# EAGLE design attiny85 (EAGLE 9.6.2)
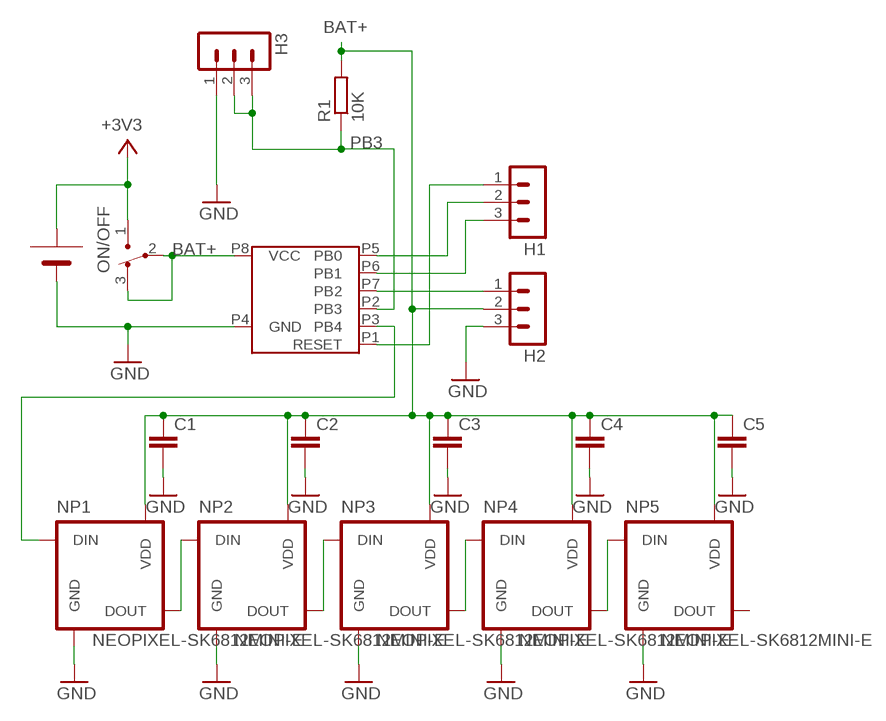
[diagram p0: schematic, sheet 1]

## Parts
ATTINY85-1  ATTINY85  ATTINY85SOP8  [ATTINY85-20SUR]
BAT1  BAT-CR2032C  [BAT-CR2032-3]
C1  C-EUC2012  [C2012]
C2  C-EUC2012  [C2012]
C3  C-EUC2012  [C2012]
C4  C-EUC2012  [C2012]
C5  C-EUC2012  [C2012]
H1  PINHEAD-MA03-1SMD  [PINHEAD-MA03-2]
H2  PINHEAD-MA03-1SMD  [PINHEAD-MA03-2]
H3  PINHEAD-MA03-1  [PINHEAD-MA03-1]
NP1  NEOPIXEL-SK6812MINI-E  [SK6812MINI-E]
NP2  NEOPIXEL-SK6812MINI-E  [SK6812MINI-E]
NP3  NEOPIXEL-SK6812MINI-E  [SK6812MINI-E]
NP4  NEOPIXEL-SK6812MINI-E  [SK6812MINI-E]
NP5  NEOPIXEL-SK6812MINI-E  [SK6812MINI-E]
ON/OFF  POWER  SW3-1  [SW3-1]
R1  10K  R-EU_M3216  [M3216]

## Nets
+3V3: BAT1.V+(BAT+) ON/OFF.1
BAT+: ATTINY85-1.P8(VCC) C1.1 C2.1 C3.1 C4.1 C5.1 H2.2 NP1.VDD NP2.VDD NP3.VDD NP4.VDD NP5.VDD ON/OFF.2 ON/OFF.3 R1.2
GND: ATTINY85-1.P4(GND) BAT1.V- C1.2 C2.2 C3.2 C4.2 C5.2 H2.3 H3.1 NP1.GND NP2.GND NP3.GND NP4.GND NP5.GND
N$1: ATTINY85-1.P3(PB4) NP1.DIN
N$2: ATTINY85-1.P7(PB2) H2.1
N$3: ATTINY85-1.P6(PB1) H1.3
N$4: ATTINY85-1.P1(RESET) H1.1
N$5: ATTINY85-1.P5(PB0) H1.2
N$6: NP1.DOUT NP2.DIN
N$7: NP2.DOUT NP3.DIN
N$8: NP3.DOUT NP4.DIN
N$9: NP4.DOUT NP5.DIN
PB3: ATTINY85-1.P2(PB3) H3.2 H3.3 R1.1
Unconnected: NP5.DOUT

## Library data of the parts
ATTINY85-1 = ytani1:ATTINY85
BAT1 = ytani1:BAT-CR2032
C1-C5 = rcl:C-EU: CAPACITOR, European symbol; SPICEPREFIX: C
H1 H2 = ytani1:PINHEAD-MA03-1: PIN HEADER
H3 = ytani1:PINHEAD-MA03-1: PIN HEADER; OC_FARNELL: unknown; OC_NEWARK: unknown
NP1-NP5 = ytani1:NEOPIXEL
ON/OFF = ytani1:SW3-1: Slide Switch 3x1 pin https://www.amazon.co.jp/gp/product/B01LYVYQNO/ SS12D00G3 2ポジションSPDT 1P2T 3ピン; MF: HiLetgo; URL_AMAZON: https://www.amazon.co.jp/gp/product/B01LYVYQNO/
R1 = rcl:R-EU_: RESISTOR, European symbol; SPICEPREFIX: R

## Board
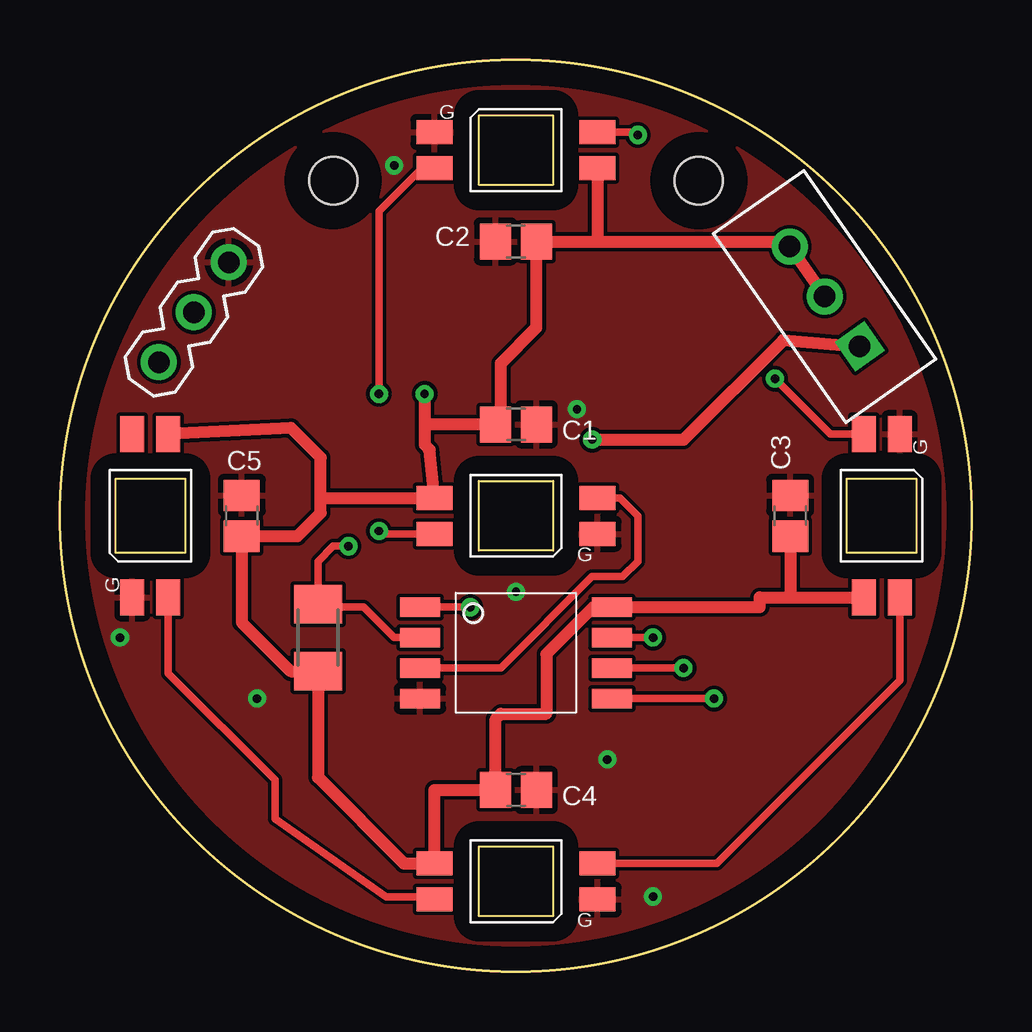
[diagram p1: board, top side]
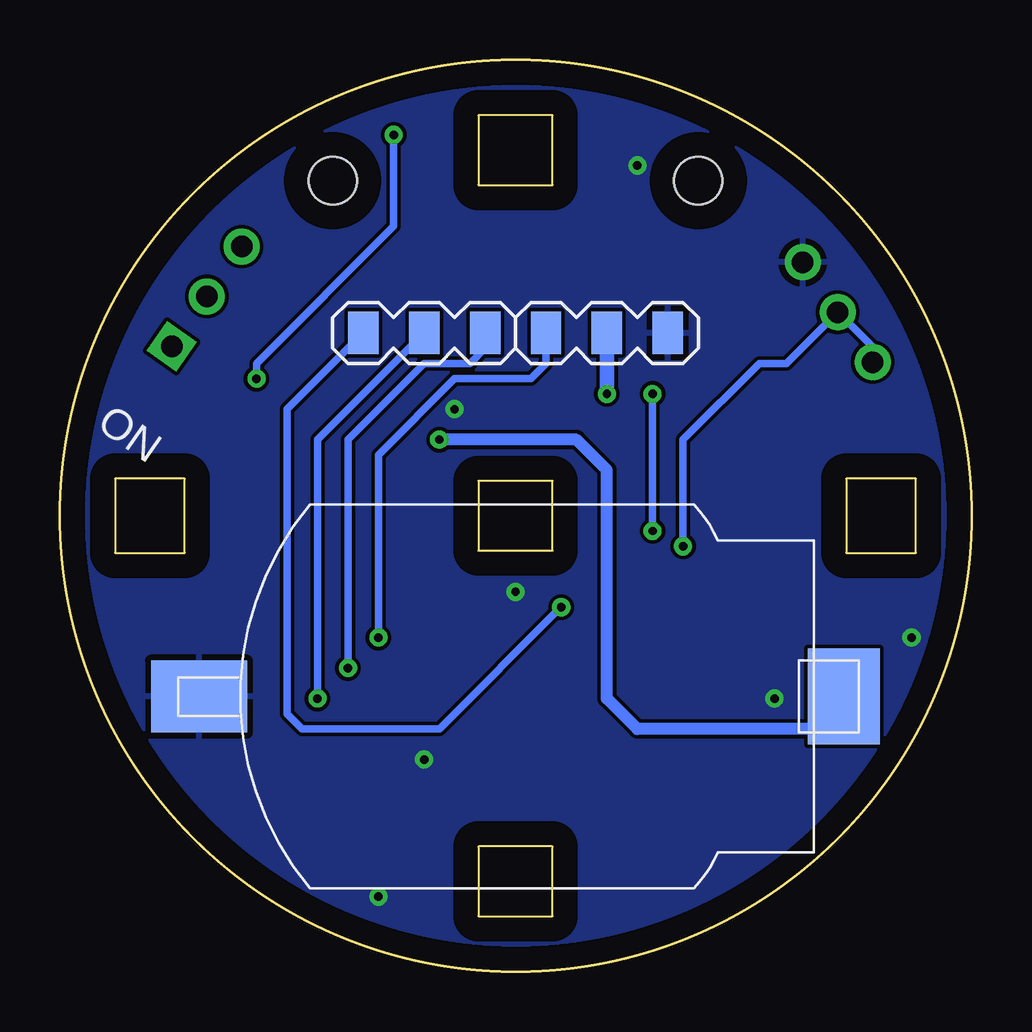
[diagram p2: board, bottom side, seen from below]

Size 38 x 38 mm. Coordinates in mm from the lower left corner, seen from the top.
Outline: circle at 19,19 radius 19
Copper layers (1*16): Top 0.035mm / dielectric 1.5mm / Bottom 0.035mm
Design rules "default": minimum track width 6mil, minimum drill 0.35mm, track to track 6mil, track to pad 6mil, pad to pad 6mil, via to via 6mil, smd to smd 6mil, copper to edge 40mil, drill to drill 6mil, minimum pad ring 10mil, minimum via ring 8mil, stop-mask expansion 4mil, vias tented up to drill 0mil, thermal gap 10mil
Holes 2 mm at 11.39,32.97 26.63,32.97

### Footprints (pad centres in the part's own frame; a part is rotated, then mirrored left to right if it is on the bottom)
ATTINY85-20SUR = smd 1.676 x 0.813: P1 -4,1.905; P2 -4,0.635; P3 -4,-0.635; P4 -4,-1.905; P5 4,-1.905; P6 4,-0.635; P7 4,0.635; P8 4,1.905
BAT-CR2032-3 = smd 4 x 3: V+ 0,-13.95 | smd 3 x 4: V- 0,12.925
C2012 = smd 1.3 x 1.5: 1 -0.85,0; 2 0.85,0
PINHEAD-MA03-2 = smd 1.27 x 1.778: 1 -1.27,0; 2 1.27,0; 3 3.81,0
PINHEAD-MA03-1 = drill 0.9 pad 1.5: 1 -1.27,0; 2 1.27,0; 3 3.81,0
SK6812MINI-E = smd 1.5 x 1: DIN 3.4,0.75; DOUT -3.4,-0.75; GND 3.4,-0.75; VDD -3.4,0.75
SW3-1 = drill 0.9 pad 1.5 square: 1 -1.27,0 | drill 0.9 pad 1.5: 2 1.27,0; 3 3.81,0
M3216 = smd 1.6 x 2: 1 -1.4,0; 2 1.4,0

### Placement (x,y rotation side)
ATTINY85-1  19.01,13.29 0 top
BAT1  19.27,11.46 90 bottom
C1  19.01,22.81 0 top
C2  19.01,30.43 180 top
C3  30.44,19 90 top
C4  19.01,7.57 0 top
C5  7.58,19 90 top
H1  24.09,26.62 0 bottom
H2  16.47,26.62 0 bottom
H3  6.31,28.52 235 top
NP1  19.01,19 0 top
NP2  19.01,34.24 180 top
NP3  34.25,19 90 top
NP4  19.01,3.76 0 top
NP5  3.77,19 270 top
ON/OFF  32.61,27.1 125 top
R1  10.75,13.92 270 top

### Tracks (layer width: path | path; a pad name or v marks a point on that pad's centre or on a via)
+3V3  (via drill 0.35)
  Top 0.508: v22.18,22.18 25.99,22.18 30.15,26.33 ON/OFF.1
  Bottom 0.508: v22.18,22.18 16.47,22.18 15.2,20.91 15.2,11.38 13.93,10.11 5.67,10.11 5.21,10.58 BAT1.V+
BAT+  (via drill 0.35)
  Top 0.508: 22.41,30.43 C2.1 19.86,26.84 18.38,25.35 18.38,23.03 C1.1 15.2,22.81 | NP2.VDD 22.41,30.43 | 10.87,19.75 NP1.VDD 15.41,21.75 15.2,21.96 15.2,22.81 | 10.87,19.75 10.87,21.43 9.63,22.66 NP5.VDD | v15.2,24.08 15.2,22.81 | 10.87,19.75 10.87,19.12 9.91,18.15 C5.1 7.58,14.55 9.61,12.52 R1.2 10.75,8.09 14.33,4.51 NP4.VDD 15.61,7.57 C4.1 18.16,10.53 18.38,10.75 20.28,10.75 20.28,13.24 22.23,15.19 ATTINY85-1.P8 29.17,15.19 29.17,15.6 30.44,15.6 | 30.44,15.6 NP3.VDD | ON/OFF.2 ON/OFF.3 30.22,30.43 22.41,30.43 | C3.1 30.44,15.6
  Bottom 0.61: H2.2 v15.2,24.08
GND  (via drill 0.35)
  other vias: 19.01,15.83 22.82,8.84 8.21,11.38 24.72,3.13 13.93,33.61 2.5,13.92 21.55,23.45
  pour Top: 11.39,39.32 26.63,39.32 39.33,26.62 39.33,-1.54 -1.49,-1.54 -1.49,26.44
  pour Bottom: 12.02,40.59 26.63,40.59 40.6,26.62 40.6,10.75 27.27,-2.59 12.02,-2.59 -2.58,12.02 -2.58,25.98
N$1
  Top 0.305: ATTINY85-1.P3 18.38,12.65 22.18,16.46 23.45,16.46 24.09,17.1 24.09,19 23.34,19.75 NP1.DIN
N$2  (via drill 0.35)
  Top 0.305: ATTINY85-1.P7 v24.72,13.92
  Bottom 0.305: v24.72,13.92 24.72,21.54 21.55,24.71 18.38,24.71 17.74,25.35 H2.1
N$3  (via drill 0.35)
  Top 0.305: ATTINY85-1.P6 v25.99,12.65
  Bottom 0.305: v25.99,12.65 25.99,22.18 22.82,25.35 20.91,25.35 20.28,25.98 H1.3
N$4  (via drill 0.35)
  Top 0.305: ATTINY85-1.P1 v17.11,15.19
  Bottom 0.305: v17.11,15.19 22.18,10.11 27.9,10.11 28.53,10.75 28.53,23.45 H1.1
N$5  (via drill 0.35)
  Top 0.305: ATTINY85-1.P5 v27.27,11.38
  Bottom 0.305: v27.27,11.38 27.27,22.18 H1.2
N$6  (via drill 0.35)
  Top 0.305: NP1.DOUT 13.41,18.25 v13.29,18.37 | v13.29,24.08 13.29,31.7 15.09,33.49 NP2.DIN
  Bottom 0.305: v13.29,24.08 v13.29,18.37
N$7  (via drill 0.35)
  Top 0.305: NP2.DOUT 23.97,34.99 v24.09,34.88 | NP3.DIN 32.12,22.4 v29.8,24.71
  Bottom 0.305: v24.09,34.88 24.09,31.07 29.8,25.35 v29.8,24.71
N$8
  Top 0.305: NP3.DOUT 35,12.13 27.38,4.51 NP4.DIN
N$9
  Top 0.305: NP4.DOUT 15.5,3.13 13.6,3.13 8.96,6.37 8.96,7.98 4.52,12.43 NP5.DIN
PB3  (via drill 0.35)
  Top 0.305: ATTINY85-1.P2 13.93,13.92 12.66,15.19 10.88,15.19 R1.1 10.75,17.1 11.39,17.73 v12.02,17.73
  Bottom 0.305: v12.02,17.73 12.02,22.18 8.85,25.35 7.72,25.35 H3.2 4.12,26.03 H3.3

### Text on the board
bPlace: ON